# Altium project SwarmReceiver.PrjPCB
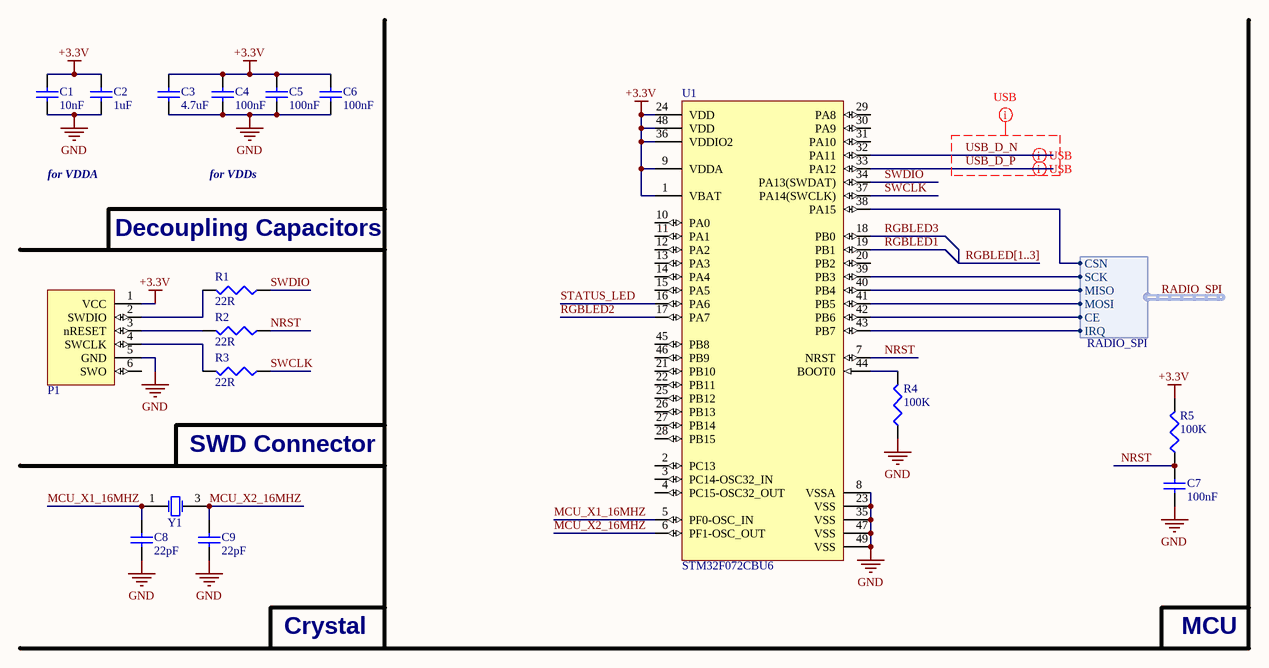
[diagram p0: SRMicrocontroller.SchDoc]
3 sheets, 44 parts. Net scope: global (net labels, ports and power ports of the same name join across sheets).
Board file: SwarmReceiver.PcbDoc
Sheets:
  SRMicrocontroller.SchDoc
  SRPeripherals.SchDoc
  SRRadio.SchDoc

## Sheet SRMicrocontroller.SchDoc
size A4

### Parts
C1  10nF  [0402]
C2  1uF  [0603]
C3  4.7uF  [0603]
C4  100nF  [0402]
C5  100nF  [0402]
C6  100nF  [0402]
C7  100nF  [0402]
C8  22pF  [0402]
C9  22pF  [0402]
P1  TC2030-IDC-NL  [TC2030-IDC-NL]  (value not drawn)
R1  22R  [0402]
R2  22R  [0402]
R3  22R  [0402]
R4  100K  [0402]
R5  100K  [0402]
U1  STM32F072CBU6  [QFN50P700X700X60_HS-49L]
Y1  7V-16.000MAAE-T  [3.2x2.5 CRYSTAL]  (value not drawn)

### Harnesses
RADIO_SPI: MOSI, MISO, SCK, CSN, CE, IRQ

### Nets
+3.3V: C1.2 C2.2 C3.2 C4.2 C5.2 C6.2 P1.1(VCC) R5.2 U1.1(VBAT) U1.9(VDDA) U1.24(VDD) U1.36(VDDIO2) U1.48(VDD)
GND: C1.1 C2.1 C3.1 C4.1 C5.1 C6.1 C7.1 C8.1 C9.1 P1.5(GND) R4.1 U1.8(VSSA) U1.23(VSS) U1.35(VSS) U1.47(VSS) U1.49(VSS) Y1.2(GND) Y1.4(GND)
MCU_X1_16MHZ: C8.2 U1.5(PF0-OSC_IN) Y1.1(X1)
MCU_X2_16MHZ: C9.2 U1.6(PF1-OSC_OUT) Y1.3(X2)
NRST: C7.2 R2.1 R5.1 U1.7(NRST)
RADIO_SPI.CE: U1.42(PB6) ; harness RADIO_SPI.CE
RADIO_SPI.CSN: U1.38(PA15) ; harness RADIO_SPI.CSN
RADIO_SPI.IRQ: U1.43(PB7) ; harness RADIO_SPI.IRQ
RADIO_SPI.MISO: U1.40(PB4) ; harness RADIO_SPI.MISO
RADIO_SPI.MOSI: U1.41(PB5) ; harness RADIO_SPI.MOSI
RADIO_SPI.SCK: U1.39(PB3) ; harness RADIO_SPI.SCK
RGBLED1: U1.19(PB1)
RGBLED2: U1.17(PA7)
RGBLED3: U1.18(PB0)
STATUS_LED: U1.16(PA6)
SWCLK: R3.1 U1.37(PA14(SWCLK))
SWDIO: R1.1 U1.34(PA13(SWDAT))
USB_D_N: U1.32(PA11)
USB_D_P: U1.33(PA12)
NetP1_2: P1.2(SWDIO) R1.2
NetP1_3: P1.3(nRESET) R2.2
NetP1_4: P1.4(SWCLK) R3.2
NetR4_2: R4.2 U1.44(BOOT0)

Not connected (* = marked no-connect by the designer): P1 6(SWO); U1 2(PC13) 3(PC14-OSC32_IN) 4(PC15-OSC32_OUT) 10(PA0) 11(PA1) 12(PA2) 13(PA3) 14(PA4) 15(PA5) 20(PB2) 21(PB10) 22(PB11) 25(PB12) 26(PB13) 27(PB14) 28(PB15) 29(PA8) 30(PA9) 31(PA10) 45(PB8) 46(PB9)

### Buses and harness runs
bus RGBLED[1..3]

### Layout directives
differential pair: USB_D_N, USB_D_P
net class USB: USB_D_N, USB_D_P

### Notes on the sheet
- for VDDA
- Decoupling Capacitors
- for VDDs
- SWD Connector
- Crystal
- MCU

### Library data of the parts
C1 = 10nF: 10nF 0402 X7R 25V ±5%; Supplier 1: Farnell; Supplier Part Number 1: 1692285; Supplier 2: Digi-Key; Supplier Part Number 2: 399-1279-1-ND; Value: 10nF
C2 = 1uF: 1uF 0603 X5R 10V ±10%; Supplier 1: Farnell; Supplier Part Number 1: 1759399; Supplier 2: Digi-Key; Supplier Part Number 2: 478-1251-1-ND; Value: 1uF
C3 = 4.7uF: 4.7uF 0603 X5R 10V ±10%; Supplier 1: Farnell; Supplier Part Number 1: 2362098; Supplier 2: Digi-Key; Supplier Part Number 2: 445-5170-1-ND; Value: 4.7uF
C4-C7 = 100nF: 100nF 0402 X7R 16V ±10%; Supplier 1: Farnell; Supplier Part Number 1: 1288252; Supplier 2: Digi-Key; Supplier Part Number 2: 399-3521-1-ND; Value: 100nF
C8 C9 = 22pF: 22pF 0402 NP0/CG0 50V ±5%; Supplier 1: Farnell; Supplier 2: Digi-Key; Supplier Part Number 1: 1414580; Supplier Part Number 2: 490-5868-1-ND; Value: 22pF
P1 = TC2030-IDC-NL: TagConnect TC2030-IDC-NL SWD Programming Connector
R1-R3 = 22R: 22R 0402 1/16W ±1%; Supplier 1: Farnell; Supplier 2: Digi-Key; Supplier Part Number 1: 2072797; Supplier Part Number 2: 541-22.0LCT-ND; Value: 22R
R4 R5 = 100K: 100K 0402 1/16W ±1%; Supplier 1: Farnell; Supplier Part Number 1: 2072519; Supplier 2: Digi-Key; Supplier Part Number 2: 541-100KLCT-ND; Value: 100K
U1 = STM32F072CBU6: STMICROELECTRONICS  STM32F072CBU6  MCU 32 BITS CORTEX-M0 48MHZ UFQFPN-48; Supplier 1: Farnell; Supplier 2: Digi-Key; Supplier Part Number 1: 2432095; Supplier Part Number 2: 497-14646-ND
Y1 = 7V-16.000MAAE-T: TXC - 7V-16.000MAAE-T, 16MHZ, 30PPM, 12PF - CRYSTAL; Supplier 1: Digi-Key; Supplier 2: Farnell; Supplier Part Number 1: 887-1462-1-ND; Supplier Part Number 2: 1892172

## Sheet SRPeripherals.SchDoc
size A4
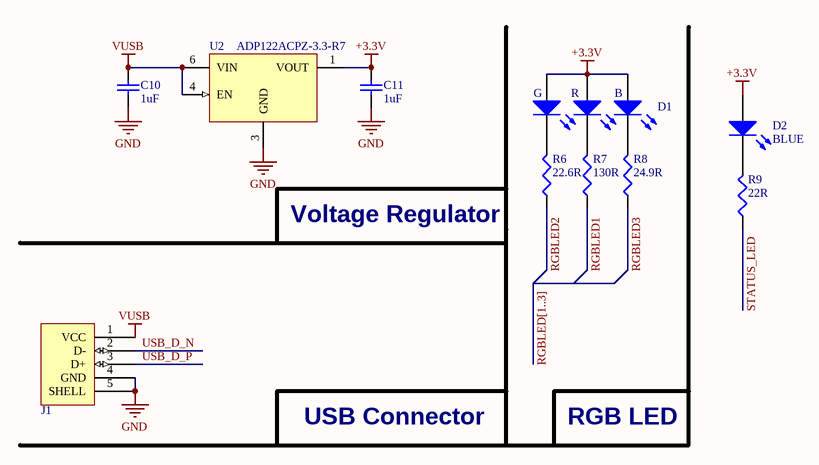
[diagram p1: SRPeripherals.SchDoc]

### Parts
C10  1uF  [0603]
C11  1uF  [0603]
D1  SMLVN6RGB1W1  [3.5x2.8 mm 6-SMD]  (value not drawn)
D2  value BLUE  [0603 - LED]  (hidden comment: BLUE LED)
J1  48037-2200  [48037-2200]  (value not drawn)
R6  22.6R  [0402]
R7  130R  [0402]
R8  24.9R  [0402]
R9  22R  [0402]
U2  ADP122ACPZ-3.3-R7  [LFCSP-6 2.0X2.0X0.55]

### Nets
+3.3V: C11.2 D1.1(AB) D1.2(AR) D1.3(AG) D2.1(A) U2.1(VOUT)
GND: C10.1 C11.1 J1.4(GND) J1.5(SHELL) U2.2(NC) U2.3(GND) U2.5(NC) U2.7(THPAD)
VUSB: C10.2 J1.1(VCC) U2.4(EN) U2.6(VIN)
RGBLED1: R7.1
RGBLED2: R6.1
RGBLED3: R8.1
STATUS_LED: R9.1
USB_D_N: J1.2(D-)
USB_D_P: J1.3(D+)
NetD1_4: D1.4(KG) R6.2
NetD1_5: D1.5(KR) R7.2
NetD1_6: D1.6(KB) R8.2
NetD2_2: D2.2(K) R9.2

### Buses and harness runs
bus RGBLED[1..3]

### Notes on the sheet
- (near R6) Voltage Regulator
- USB Connector
- RGB LED
- (in symbol SMLVN6RGB1W1) G; R; B

### Library data of the parts
C10 C11 = 1uF: 1uF 0603 X5R 10V ±10%; Supplier 1: Farnell; Supplier Part Number 1: 1759399; Supplier 2: Digi-Key; Supplier Part Number 2: 478-1251-1-ND; Value: 1uF
D1 = SMLVN6RGB1W1: ROHM SMLVN6RGB1W1 LED Tri-Color Blue/Green/Red Chip LED 6-Pin 1411 T/RLED Tri-Color Blue/Green/Red Chip LED 6-Pin 1411; Supplier 1: Mouser; Supplier 2: Digi-Key; Supplier Part Number 1: 755-SMLVN6RGB1W1; Supplier Part Number 2: 846-1187-1-ND
D2 = BLUE LED: BRIGHT BLUE LED 20mA; Supplier 1: Farnell; Supplier Part Number 1: 1716770; Supplier 2: Digi-Key; Supplier Part Number 2: 160-1646-1-ND
J1 = 48037-2200: Molex USB 2.0 Connector Plug USB Type A; Supplier 1: Farnell; Supplier 2: Digi-Key; Supplier Part Number 1: 2313729; Supplier Part Number 2: WM3983CT-ND
R6 = 22.6R: 22.6R 0402 1/16W ±0.05R; Supplier 1: Farnell; Supplier 2: Digi-Key; Supplier Part Number 1: 2302454; Supplier Part Number 2: P22.6LCT-ND; Value: 22.6R
R7 = 130R: 130R 0402 1/16W ±0.05R; Supplier 1: Farnell; Supplier 2: Digi-Key; Supplier Part Number 1: 2059115; Supplier Part Number 2: P130LCT-ND; Value: 130R
R8 = 24.9R: 24.9R 0402 1/16W ±0.05R; Supplier 1: Farnell; Supplier 2: Digi-Key; Supplier Part Number 1: 2059102; Supplier Part Number 2: P24.9LCT-ND; Value: 24.9R
R9 = 22R: 22R 0402 1/16W ±1%; Supplier 1: Farnell; Supplier 2: Digi-Key; Supplier Part Number 1: 2072797; Supplier Part Number 2: 541-22.0LCT-ND; Value: 22R
U2 = ADP122ACPZ-3.3-R7: Analog Devices ADP122ACPZ-3.3-R7 - 5.5 V Input, 300 mA, Low Quiescent  Current, CMOS Linear Regulator; Supplier 1: Farnell; Supplier 2: Digi-Key; Supplier Part Number 1: 2457164; Supplier Part Number 2: ADP122ACPZ-3.3-R7CT-ND

## Sheet SRRadio.SchDoc
size A4
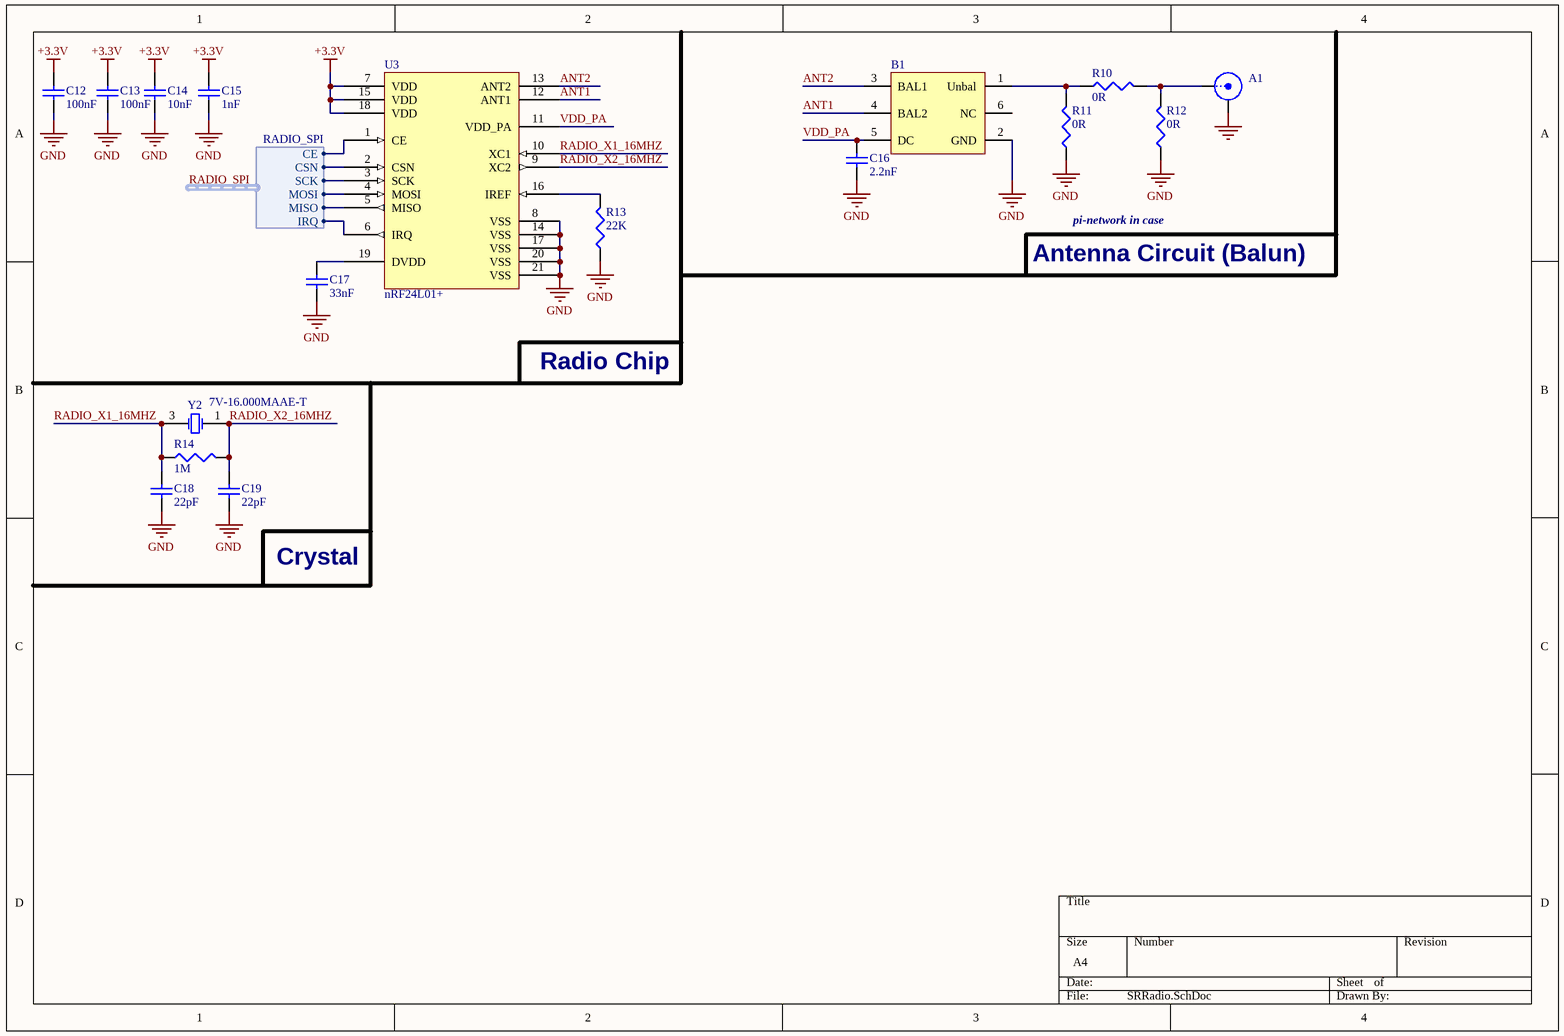
[diagram p2: SRRadio.SchDoc]

### Parts
A1  142-4701-801  [142-4701-801]  (value not drawn)
B1  2450BM14A0002T  [2450BM14A0002]  (value not drawn)
C12  100nF  [0402]
C13  100nF  [0402]
C14  10nF  [0402]
C15  1nF  [0402]
C16  2.2nF  [0402]
C17  33nF  [0402]
C18  22pF  [0402]
C19  22pF  [0402]
R10  0R  [0402]
R11  0R  [0402]
R12  0R  [0402]
R13  value 22K  [0402]  (hidden comment: 22K 0402 1/16W ±1%)
R14  1M  [0402]
U3  nRF24L01+  [QFN50P400X400X95_HS-21L]
Y2  7V-16.000MAAE-T  [3.2x2.5 CRYSTAL]

### Harnesses
RADIO_SPI: MOSI, MISO, SCK, CSN, CE, IRQ

### Nets
+3.3V: C12.2 C13.2 C14.2 C15.2 U3.7(VDD) U3.15(VDD) U3.18(VDD)
GND: A1.2(Y) B1.2(GND) C12.1 C13.1 C14.1 C15.1 C16.1 C17.1 C18.1 C19.1 R11.1 R12.1 R13.1 U3.8(VSS) U3.14(VSS) U3.17(VSS) U3.20(VSS) U3.21(VSS) Y2.2(GND) Y2.4(GND)
ANT1: B1.4(BAL2) U3.12(ANT1)
ANT2: B1.3(BAL1) U3.13(ANT2)
RADIO_SPI.CE: U3.1(CE) ; harness RADIO_SPI.CE
RADIO_SPI.CSN: U3.2(CSN) ; harness RADIO_SPI.CSN
RADIO_SPI.IRQ: U3.6(IRQ) ; harness RADIO_SPI.IRQ
RADIO_SPI.MISO: U3.5(MISO) ; harness RADIO_SPI.MISO
RADIO_SPI.MOSI: U3.4(MOSI) ; harness RADIO_SPI.MOSI
RADIO_SPI.SCK: U3.3(SCK) ; harness RADIO_SPI.SCK
RADIO_X1_16MHZ: C18.2 R14.1 U3.10(XC1) Y2.3(X2)
RADIO_X2_16MHZ: C19.2 R14.2 U3.9(XC2) Y2.1(X1)
VDD_PA: B1.5(DC) C16.2 U3.11(VDD_PA)
NetA1_1: A1.1(X) R10.2 R12.2
NetB1_1: B1.1(Unbal) R10.1 R11.2
NetC17_2: C17.2 U3.19(DVDD)
NetR13_2: R13.2 U3.16(IREF)

Not connected (* = marked no-connect by the designer): B1 6(NC)

### Notes on the sheet
- pi-network in case
- Antenna Circuit (Balun)
- Radio Chip
- Crystal

### Library data of the parts
A1 = 142-4701-801: JOHNSON  142-4701-801  SMA FEMELLE REVERSE POLARITY TERMINAISON; Supplier 1: Farnell; Supplier Part Number 1: 2340523; Supplier 2: Digi-Key; Supplier Part Number 2: J917-ND
B1 = 2450BM14A0002T: Johanson Technology Impedance Matched Balun Filter Integrated Passive for nRF24L01; Supplier 1: Farnell; Supplier 2: Digi-Key; Supplier Part Number 1: 2148533; Supplier Part Number 2: 712-1574-1-ND
C12 C13 = 100nF: 100nF 0402 X7R 16V ±10%; Supplier 1: Farnell; Supplier Part Number 1: 1288252; Supplier 2: Digi-Key; Supplier Part Number 2: 399-3521-1-ND; Value: 100nF
C14 = 10nF: 10nF 0402 X7R 25V ±5%; Supplier 1: Farnell; Supplier Part Number 1: 1692285; Supplier 2: Digi-Key; Supplier Part Number 2: 399-1279-1-ND; Value: 10nF
C15 = 1nF: 1nF 0402 X7R 50V ±10%; Supplier 1: Farnell; Supplier 2: Digi-Key; Supplier Part Number 1: 1414573; Supplier Part Number 2: 399-1032-1-ND; Value: 1nF
C16 = 2.2nF: 2.2nF 0402 X7R 50V ±10%; Supplier 1: Farnell; Supplier 2: Digi-Key; Supplier Part Number 1: 1414582; Supplier Part Number 2: 399-3068-1-ND; Value: 2.2nF
C17 = 33nF: 33nF 0402 X7R 50V ±10%; Supplier 1: Farnell; Supplier 2: Digi-Key; Supplier Part Number 1: 2210826; Supplier Part Number 2: 445-7334-1-ND; Value: 33nF
C18 C19 = 22pF: 22pF 0402 NP0/CG0 50V ±5%; Supplier 1: Farnell; Supplier 2: Digi-Key; Supplier Part Number 1: 1414580; Supplier Part Number 2: 490-5868-1-ND; Value: 22pF
R10-R12 = 0R: 0R 0402 1/16W ±0.05R; Supplier 1: Farnell; Supplier 2: Digi-Key; Supplier Part Number 1: 2072513; Supplier Part Number 2: P0.0JCT-ND; Value: 0R
R13 = 22K: Supplier 1: Farnell; Supplier 2: Digi-Key; Supplier Part Number 1: 2072781; Supplier Part Number 2: 541-22.0KLCT-ND
R14 = 1M: 1M 0402 1/16W ±1%; Supplier 1: Farnell; Supplier Part Number 1: 2072521; Supplier 2: Digi-Key; Supplier Part Number 2: P1.00MLCT-ND; Value: 1M
U3 = nRF24L01+: Nordic Semi Ultra low power 2.4GHz RF Transceiver IC; Supplier 1: Digi-Key; Supplier Part Number 1: 1490-1033-1-ND
Y2 = 7V-16.000MAAE-T: as Y1 on sheet SRMicrocontroller; Supplier 1: Digi-Key; Supplier 2: Farnell; Supplier Part Number 1: 887-1462-1-ND; Supplier Part Number 2: 1892172

## Nets that join several sheets
+3.3V: SRMicrocontroller (13 pins), SRPeripherals (6 pins), SRRadio (7 pins)
GND: SRMicrocontroller (18 pins), SRPeripherals (8 pins), SRRadio (20 pins)
RADIO_SPI.CE: SRMicrocontroller (U1.42), SRRadio (U3.1)
RADIO_SPI.CSN: SRMicrocontroller (U1.38), SRRadio (U3.2)
RADIO_SPI.IRQ: SRMicrocontroller (U1.43), SRRadio (U3.6)
RADIO_SPI.MISO: SRMicrocontroller (U1.40), SRRadio (U3.5)
RADIO_SPI.MOSI: SRMicrocontroller (U1.41), SRRadio (U3.4)
RADIO_SPI.SCK: SRMicrocontroller (U1.39), SRRadio (U3.3)
RGBLED1: SRMicrocontroller (U1.19), SRPeripherals (R7.1)
RGBLED2: SRMicrocontroller (U1.17), SRPeripherals (R6.1)
RGBLED3: SRMicrocontroller (U1.18), SRPeripherals (R8.1)
STATUS_LED: SRMicrocontroller (U1.16), SRPeripherals (R9.1)
USB_D_N: SRMicrocontroller (U1.32), SRPeripherals (J1.2)
USB_D_P: SRMicrocontroller (U1.33), SRPeripherals (J1.3)